# EAGLE schematic n64cart (EAGLE 9.6.2)
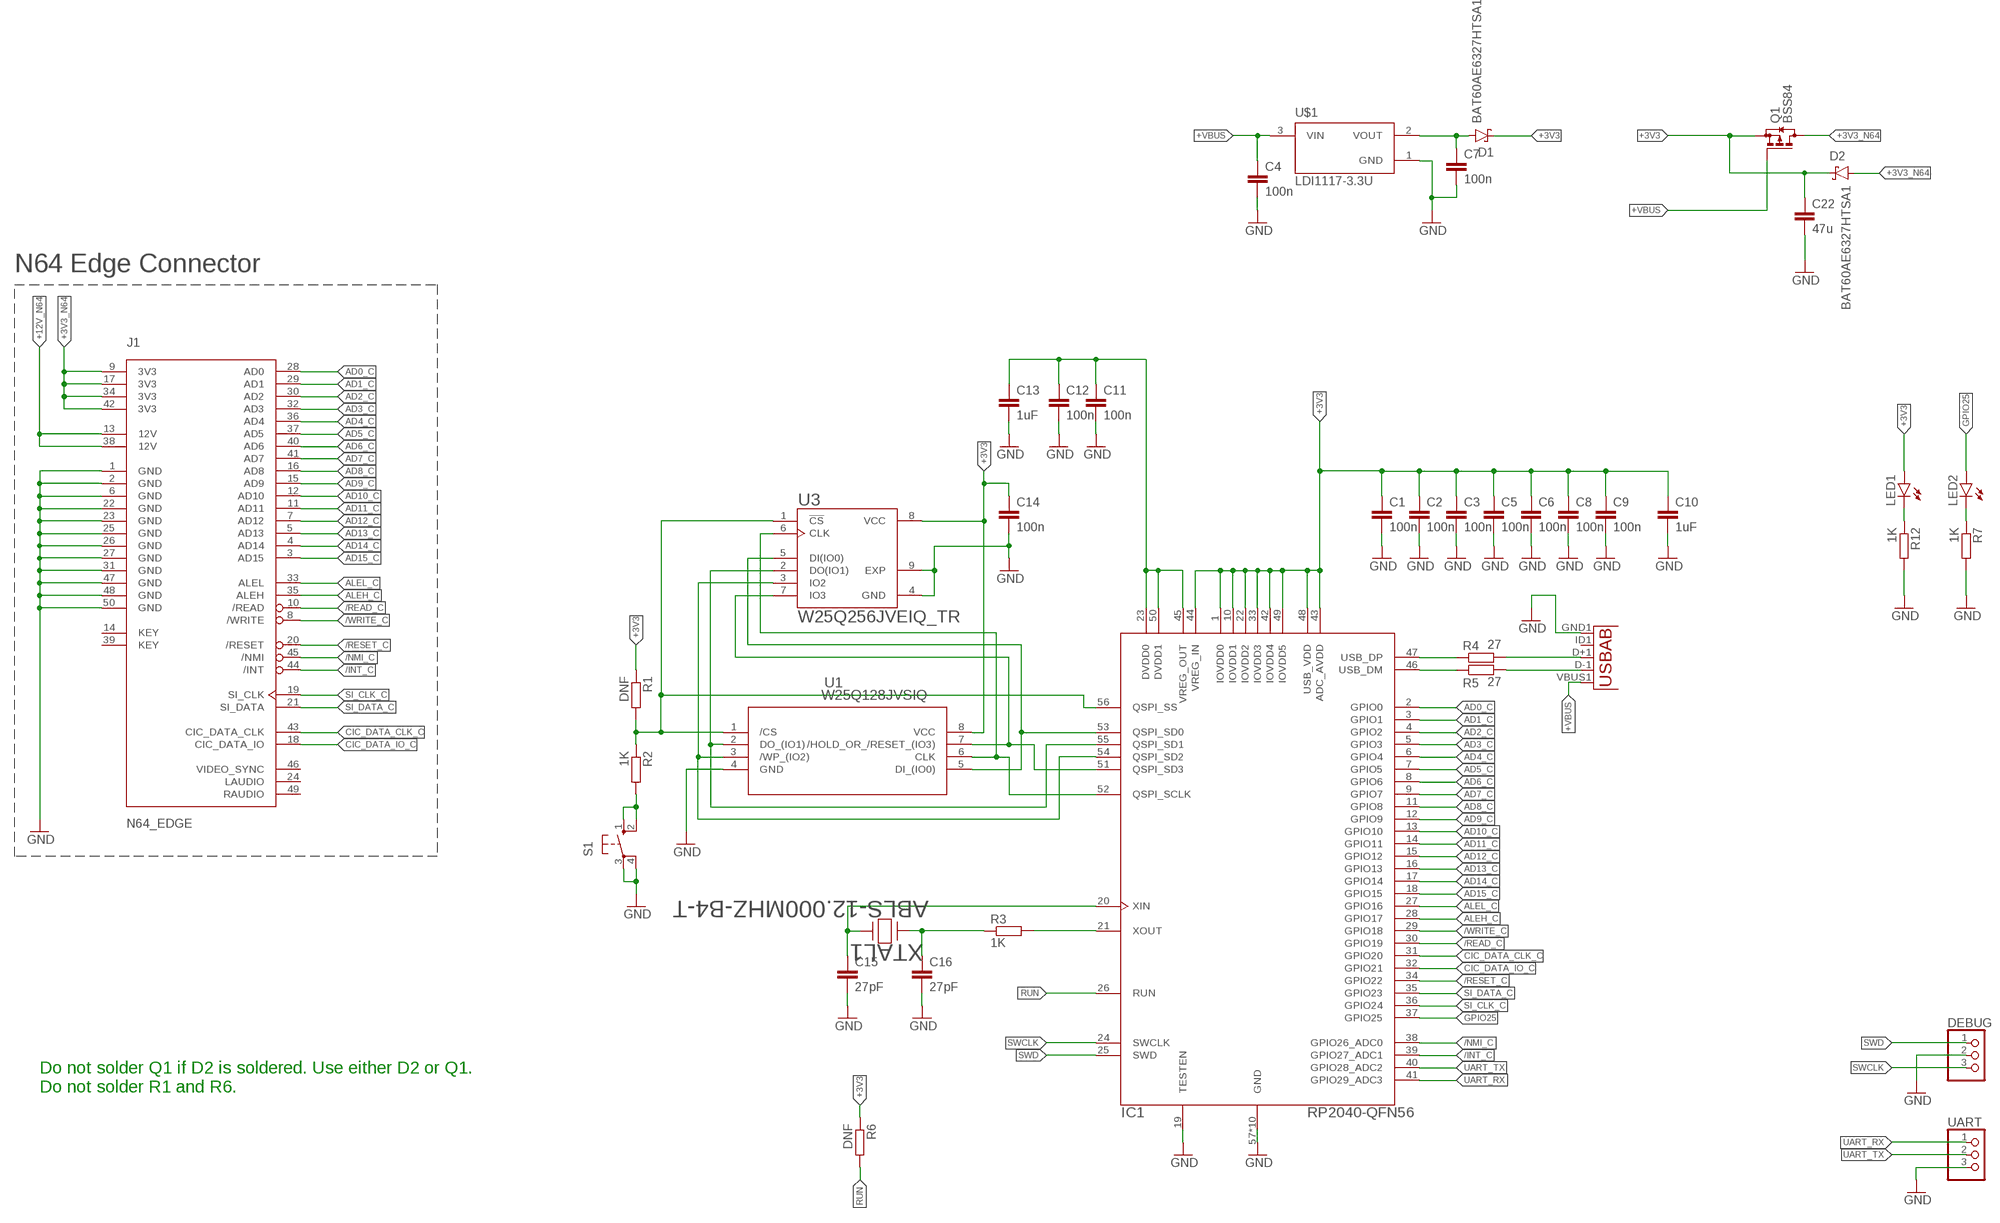
[diagram p0: schematic, sheet 1]

## Parts
C1  100n  C-EUC0402  [C0402]
C2  100n  C-EUC0402  [C0402]
C3  100n  C-EUC0402  [C0402]
C4  100n  C-EUC0402  [C0402]
C5  100n  C-EUC0402  [C0402]
C6  100n  C-EUC0402  [C0402]
C7  100n  C-EUC0402  [C0402]
C8  100n  C-EUC0402  [C0402]
C9  100n  C-EUC0402  [C0402]
C10  1uF  C-EUC0402  [C0402]
C11  100n  C-EUC0402  [C0402]
C12  100n  C-EUC0402  [C0402]
C13  1uF  C-EUC0402  [C0402]
C14  100n  C-EUC0402  [C0402]
C15  27pF  C-EUC0402  [C0402]
C16  27pF  C-EUC0402  [C0402]
C22  47u  C-EUC0805  [C0805]
D1  BAT60AE6327HTSA1  BAT60J  [SOD323_ST]
D2  BAT60AE6327HTSA1  BAT60J  [SOD323_ST]
DEBUG  PINHD-1X3  [1X03]
IC1  RP2040-QFN56  [RP2040-QFN-56]
J1  N64_EDGE  [N64_EDGE]
LED1  LED5MM  [LED5MM]
LED2  LED5MM  [LED5MM]
Q1  BSS84  [SOT23]
R1  DNF  R-EU_R0402  [R0402]
R2  1K  R-EU_R0402  [R0402]
R3  1K  R-EU_R0402  [R0402]
R4  27  R-EU_R0402  [R0402]
R5  27  R-EU_R0402  [R0402]
R6  DNF  R-EU_R0402  [R0402]
R7  1K  R-EU_R0402  [R0402]
R12  1K  R-EU_R0402  [R0402]
S1  10-XX  [B3F-10XX]
U1  W25Q128JVSIQ  [SOIC_128JVSIQ_WIN]
U2  USB""  [USB-MICRO-SMD]
U3  W25Q256JVEIQ_TR  [SON127P800X600X80-9N]
U$1  LDI1117-3.3U  [LDI1117-3.3U]
UART  PINHD-1X3  [1X03]
XTAL1  ABLS-12.000MHZ-B4-T  [XTAL_ABLS_ABR]

## Nets
+3V3: C1.1 C2.1 C3.1 C5.1 C6.1 C8.1 C9.1 C10.1 C14.1 C22.1 D1.C D2.C IC1.1(IOVDD0) IC1.10(IOVDD1) IC1.22(IOVDD2) IC1.33(IOVDD3) IC1.42(IOVDD4) IC1.43(ADC_AVDD) IC1.44(VREG_IN) IC1.48(USB_VDD) IC1.49(IOVDD5) LED1.A Q1.2(S) R1.1 R6.1 U1.8(VCC) U3.8(VCC)
+3V3_N64: D2.A J1.9(3V3) J1.17(3V3) J1.34(3V3) J1.42(3V3) Q1.3(D)
+12V_N64: J1.13(12V) J1.38(12V)
+VBUS: C4.1 Q1.1(G) U2.VBUS1(VBUS) U$1.3(VIN)
/INT_C: IC1.39(GPIO27_ADC1) J1.44(/INT)
/NMI_C: IC1.38(GPIO26_ADC0) J1.45(/NMI)
/READ_C: IC1.30(GPIO19) J1.10(/READ)
/RESET_C: IC1.34(GPIO22) J1.20(/RESET)
/WRITE_C: IC1.29(GPIO18) J1.8(/WRITE)
AD0_C: IC1.2(GPIO0) J1.28(AD0)
AD1_C: IC1.3(GPIO1) J1.29(AD1)
AD2_C: IC1.4(GPIO2) J1.30(AD2)
AD3_C: IC1.5(GPIO3) J1.32(AD3)
AD4_C: IC1.6(GPIO4) J1.36(AD4)
AD5_C: IC1.7(GPIO5) J1.37(AD5)
AD6_C: IC1.8(GPIO6) J1.40(AD6)
AD7_C: IC1.9(GPIO7) J1.41(AD7)
AD8_C: IC1.11(GPIO8) J1.16(AD8)
AD9_C: IC1.12(GPIO9) J1.15(AD9)
AD10_C: IC1.13(GPIO10) J1.12(AD10)
AD11_C: IC1.14(GPIO11) J1.11(AD11)
AD12_C: IC1.15(GPIO12) J1.7(AD12)
AD13_C: IC1.16(GPIO13) J1.5(AD13)
AD14_C: IC1.17(GPIO14) J1.4(AD14)
AD15_C: IC1.18(GPIO15) J1.3(AD15)
ALEH_C: IC1.28(GPIO17) J1.35(ALEH)
ALEL_C: IC1.27(GPIO16) J1.33(ALEL)
CIC_DATA_CLK_C: IC1.31(GPIO20) J1.43(CIC_DATA_CLK)
CIC_DATA_IO_C: IC1.32(GPIO21) J1.18(CIC_DATA_IO)
GND: C1.2 C2.2 C3.2 C4.2 C5.2 C6.2 C7.2 C8.2 C9.2 C10.2 C11.2 C12.2 C13.2 C14.2 C15.2 C16.2 C22.2 DEBUG.2 IC1.19(TESTEN) IC1.57(GND) IC1.58(GND) IC1.59(GND) IC1.60(GND) IC1.61(GND) IC1.62(GND) IC1.63(GND) IC1.64(GND) IC1.65(GND) IC1.66(GND) J1.1(GND) J1.2(GND) J1.6(GND) J1.22(GND) J1.23(GND) J1.25(GND) J1.26(GND) J1.27(GND) J1.31(GND) J1.47(GND) J1.48(GND) J1.50(GND) R7.2 R12.2 S1.3(P) S1.4(P1) U1.4(GND) U2.GND1(GND) U3.4(GND) U3.9(EXP) U$1.1(GND) UART.3
GPIO25: IC1.37(GPIO25) LED2.A
N$1: C7.1 D1.A U$1.2(VOUT)
N$2: R5.2 U2.D-1(D-)
N$3: R4.2 U2.D+1(D+)
N$4: LED2.K(C) R7.1
N$5: C11.1 C12.1 C13.1 IC1.23(DVDD0) IC1.45(VREG_OUT) IC1.50(DVDD1)
N$6: LED1.K(C) R12.1
N$9: IC1.53(QSPI_SD0) U1.5(DI_(IO0)) U3.5(DI(IO0))
N$11: IC1.51(QSPI_SD3) U1.7(/HOLD_OR_/RESET_(IO3)) U3.7(IO3)
N$12: IC1.52(QSPI_SCLK) U1.6(CLK) U3.6(CLK)
N$13: IC1.56(QSPI_SS) R1.2 R2.1 U1.1(/CS) U3.1(!CS)
N$14: IC1.55(QSPI_SD1) U1.2(DO_(IO1)) U3.2(DO(IO1))
N$15: IC1.54(QSPI_SD2) U1.3(/WP_(IO2)) U3.3(IO2)
N$16: R2.2 S1.1(S) S1.2(S1)
N$17: C16.1 R3.1 XTAL1.1
N$18: C15.1 IC1.20(XIN) XTAL1.2
N$19: IC1.21(XOUT) R3.2
N$20: IC1.47(USB_DP) R4.1
N$21: IC1.46(USB_DM) R5.1
RUN: IC1.26(RUN) R6.2
SI_CLK_C: IC1.36(GPIO24) J1.19(SI_CLK)
SI_DATA_C: IC1.35(GPIO23) J1.21(SI_DATA)
SWCLK: DEBUG.3 IC1.24(SWCLK)
SWD: DEBUG.1 IC1.25(SWD)
UART_RX: IC1.41(GPIO29_ADC3) UART.1
UART_TX: IC1.40(GPIO28_ADC2) UART.2
Unconnected: J1.14(KEY) J1.24(LAUDIO) J1.39(KEY) J1.46(VIDEO_SYNC) J1.49(RAUDIO) U2.ID1(USBID)

## Notes on the sheet
- N64 Edge Connector
- Do not solder Q1 if D2 is soldered. Use either D2 or Q1.
  Do not solder R1 and R6.

## Library data of the parts
C1-C16 C22 = rcl:C-EU: CAPACITOR, European symbol; SPICEPREFIX: C
D1 D2 = diode:BAT60J: Schottky barrier diode Source: www.st.com, BAT60J.pdf
DEBUG UART = pinhead:PINHD-1X3: PIN HEADER
IC1 = RpiPico:RP2040-QFN56
J1 = SummerCart64:N64_EDGE: Nintendo 64 cartridge edge connector.
LED1 LED2 = led:LED: LED OSRAM: - CHIPLED LG R971, LG N971, LY N971, LG Q971, LY Q971, LO R971, LY R971 LH N974, LH R974 LS Q976, LO Q976, LY Q976 LO Q996 - Hyper CHIPLED LW Q18S LB Q993, LB Q99A, LB R99A - SideLED LS A670, LO A670, LY A670, LG A670, LP A670 LB A673, LV A673, LT A673, LW A673 LH A674 LY A675 LS A676, LA A676, LO A676, LY A676, LW A676 LS A679, LY A679, LG A679 - Hyper Micro SIDELED® LS Y876, LA Y876, LO Y876, LY Y876 LT Y87S - SmartLED LW L88C, LW L88S LB L89C, LB L89S, LG L890 LS L89K, LO L89K, LY L89K LS L896, LA L896, LO L896, LY L896 - TOPLED LS T670, LO T670, LY T670, LG T670, LP T670 LSG T670, LSP T670, LSY T670, LOP T670, LYG T670 LG T671, LOG T671, LSG T671 LB T673, LV T673, LT T673, LW T673 LH T674 LS T676, LA T676, LO T676, LY T676, LB T676, LH T676, LSB T676, LW T676 LB T67C, LV T67C, LT T67C, LS T67K, LO T67K, LY T67K, LW E67C LS E67B, LA E67B, LO E67B, LY E67B, LB E67C, LV E67C, LT E67C LW T67C LS T679, LY T679, LG T679 LS T770, LO T770, LY T770, LG T770, LP T770 LB T773, LV T773, LT T773, LW T773 LH T774 LS E675, LA E675, LY E675, LS T675 LS T776, LA T776, LO T776, LY T776, LB T776 LHGB T686 LT T68C, LB T68C - Hyper Mini TOPLED® LB M676 - Mini TOPLED Santana® LG M470 LS M47K, LO M47K, LY M47K Source: http://www.osram.convergy.de LUXEON: - LUMILED® LXK2-PW12-R00, LXK2-PW12-S00, LXK2-PW14-U00, LXK2-PW14-V00 LXK2-PM12-R00, LXK2-PM12-S00, LXK2-PM14-U00 LXK2-PE12-Q00, LXK2-PE12-R00, LXK2-PE12-S00, LXK2-PE14-T00, LXK2-PE14-U00 LXK2-PB12-K00, LXK2-PB12-L00, LXK2-PB12-M00, LXK2-PB14-N00, LXK2-PB14-P00, LXK2-PB14-Q00 LXK2-PR12-L00, LXK2-PR12-M00, LXK2-PR14-Q00, LXK2-PR14-R00 LXK2-PD12-Q00, LXK2-PD12-R00, LXK2-PD12-S00 LXK2-PH12-R00, LXK2-PH12-S00 LXK2-PL12-P00, LXK2-PL12-Q00, LXK2-PL12-R00 Source: www.luxeon.com KINGBRIGHT: KA-3528ASYC Source: www.kingbright.com
Q1 = transistor-small-signal:BSS84: P-CHANNEL MOS FET
R1-R7 R12 = rcl:R-EU_: RESISTOR, European symbol; SPICEPREFIX: R
S1 = switch-omron:10-XX: OMRON SWITCH; MPN: B3F-1000; OC_FARNELL: 176432; OC_NEWARK: 36M3542
U1 = w25q256-soic:W25Q128JVSIQ; COPYRIGHT: Copyright (C) 2022 Ultra Librarian. All rights reserved.; DIGI-KEY_PART_NUMBER_1: W25Q128JVSIQ-ND; MANUFACTURER_PART_NUMBER: W25Q128JVSIQ; MFR_NAME: Winbond
U2 = MicroUSB:USB: This is a USB AB connector that is compatible with USB OTG. i.e. this connector can serve as a host or device
U3 = W25Q256JVEIQ_TR:W25Q256JVEIQ_TR: Ic Flash 256mbit 104mhz 8wson; DESCRIPTION: FLASH - NOR Memory IC 256Mb (32M x 8) SPI - Quad I/O 133 MHz 8-WSON (8x6); DIGI-KEY_PART_NUMBER: W25Q256JVEIQTR-ND; MF: Winbond; MP: W25Q256JVEIQ TR; PACKAGE: WSON-8 Winbond; PURCHASE-URL: https://pricing.snapeda.com/search/part/W25Q256JVEIQ TR/?ref=eda
U$1 = LDI1117-3.3U:LDI1117-3.3U
XTAL1 = abls-12.000MHZ-B4-T:ABLS-12.000MHZ-B4-T; COPYRIGHT: Copyright (C) 2022 Ultra Librarian. All rights reserved.; MANUFACTURER_PART_NUMBER: ABLS-12.000MHZ-B4-T; MFR_NAME: Abracon